# Altium schematic sheet NE-CurrentSense-V1.0.SchDoc: Oscilloscope Current Probe
size A4; SheetNumber: 1; SheetTotal: 1; ProjectName: Current Prbe
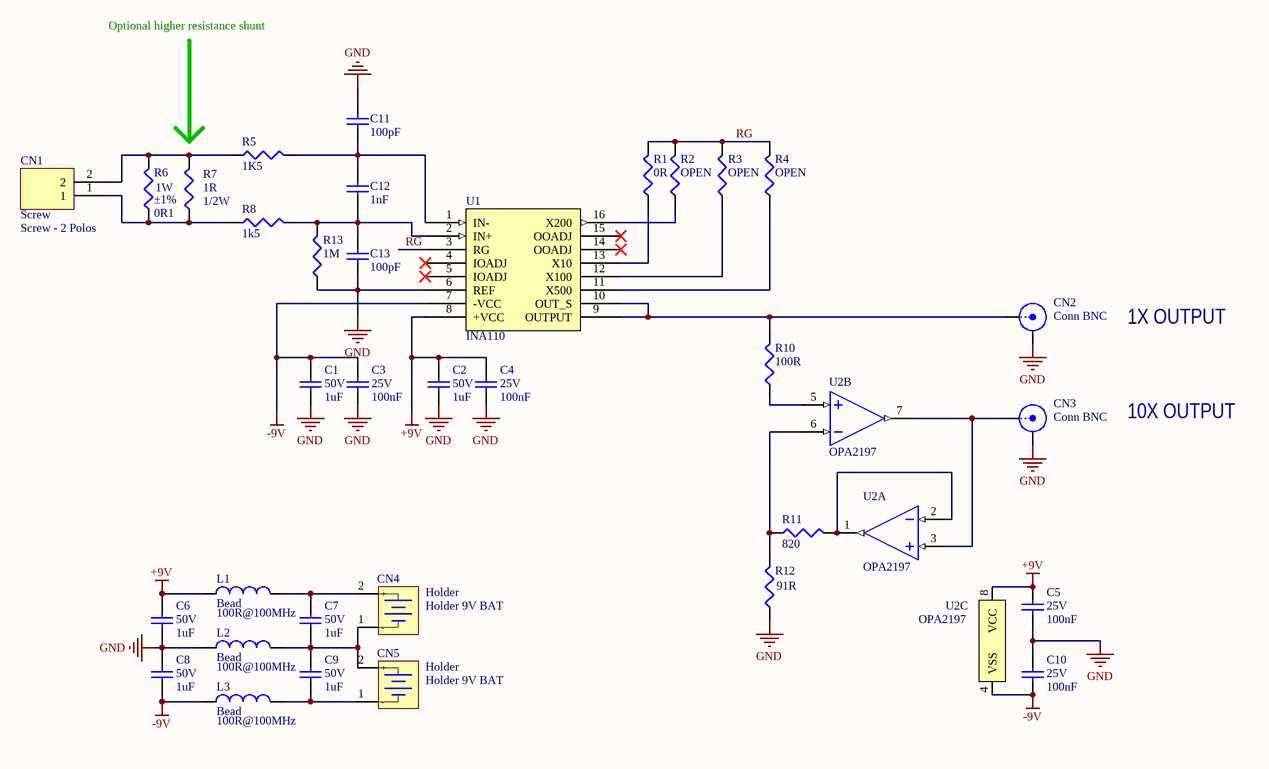
[diagram p0: NE-CurrentSense-V1.0.SchDoc]

## Parts
C1  value 1uF  Tensão: 50V  [CC0603]  (hidden comment: Capacitor Cerâmico)
C2  value 1uF  Tensão: 50V  [CC0603]  (hidden comment: Capacitor Cerâmico)
C3  value 100nF  Tensão: 25V  [CC0603]  (hidden comment: Capacitor Cerâmico)
C4  value 100nF  Tensão: 25V  [CC0603]  (hidden comment: Capacitor Cerâmico)
C5  value 100nF  Tensão: 25V  [CC0603]  (hidden comment: Capacitor Cerâmico)
C6  value 1uF  Tensão: 50V  [CC0603]  (hidden comment: Capacitor Cerâmico)
C7  value 1uF  Tensão: 50V  [CC0603]  (hidden comment: Capacitor Cerâmico)
C8  value 1uF  Tensão: 50V  [CC0603]  (hidden comment: Capacitor Cerâmico)
C9  value 1uF  Tensão: 50V  [CC0603]  (hidden comment: Capacitor Cerâmico)
C10  value 100nF  Tensão: 25V  [CC0603]  (hidden comment: Capacitor Cerâmico)
C11  value 100pF  [CC0603]  (hidden comment: Capacitor Cerâmico)  (no BOM)
C12  value 1nF  [CC0603]  (hidden comment: Capacitor Cerâmico)  (no BOM)
C13  value 100pF  [CC0603]  (hidden comment: Capacitor Cerâmico)  (no BOM)
CN1  Screw  value Screw - 2 Polos  [CONN SCREW-2N P5.08]
CN2  Conn BNC  [CONN BNC-JACK]
CN3  Conn BNC  [CONN BNC-JACK]
CN4  Holder  value Holder 9V BAT  [BATTHOLDER-9V-BH9V-PC-ND]
CN5  Holder  value Holder 9V BAT  [BATTHOLDER-9V-BH9V-PC-ND]
L1  Bead  value 100R@100MHz  [CC0603]
L2  Bead  value 100R@100MHz  [CC0603]
L3  Bead  value 100R@100MHz  [CC0603]
R1  value 0R  [CC0603]  (hidden comment: Resistor)
R2  value OPEN  [CC0603]  (hidden comment: Resistor Open)  (no BOM)
R3  value OPEN  [CC0603]  (hidden comment: Resistor Open)  (no BOM)
R4  value OPEN  [CC0603]  (hidden comment: Resistor Open)  (no BOM)
R5  value 1K5  [CC0603]  (hidden comment: Resistor)
R6  value 0R1  Potência: 1W  Tolerância: ±1%  [CC2010]  (hidden comment: Resistor)
R7  value 1R  Potência: 1/2W  [CC1206]  (hidden comment: Resistor)
R8  value 1k5  [CC0603]  (hidden comment: Resistor)
R10  value 100R  [CC0603]  (hidden comment: Resistor)
R11  value 820  [CC0603]  (hidden comment: Resistor)
R12  value 91R  [CC0603]  (hidden comment: Resistor)
R13  value 1M  [CC0603]  (hidden comment: Resistor)
U1  INA110  [SOIC-16N_WIDE]
U2  OPA2197  [SOIC-8N]  (parts A,B,C of 3)

## Nets
+9V: C2.2 C4.2 C5.2 C6.2 L1.1 U1.8(+VCC) U2.8(VCC)
-9V: C1.2 C3.2 C8.1 C10.1 L3.1 U1.7(-VCC) U2.4(VSS)
GND: C1.1 C2.1 C3.1 C4.1 C5.1 C6.1 C8.2 C10.2 C11.2 C13.1 CN2.2(Y) CN3.2(Y) L2.1 R12.1 R13.1 U1.6(REF)
RG: R1.2 R2.2 R3.2 R4.2 U1.3(RG)
NetC7_1: C7.1 C9.2 CN4.1(-) CN5.2(+) L2.2
NetC7_2: C7.2 CN4.2(+) L1.2
NetC9_1: C9.1 CN5.1(-) L3.2
NetC11_1: C11.1 C12.2 R5.2 U1.1(IN-)
NetC12_1: C12.1 C13.2 R8.2 R13.2 U1.2(IN+)
NetCN1_1: CN1.1 R6.1 R7.1 R8.1
NetCN1_2: CN1.2 R5.1 R6.2 R7.2
NetCN2_1: CN2.1(X) R10.2 U1.9(OUTPUT) U1.10(OUT_S)
NetCN3_1: CN3.1(X) U2.3(INA+) U2.7(OUTB)
NetR1_1: R1.1 U1.13(X10)
NetR2_1: R2.1 U1.16(X200)
NetR3_1: R3.1 U1.12(X100)
NetR4_1: R4.1 U1.11(X500)
NetR10_1: R10.1 U2.5(INB+)
NetR11_1: R11.1 R12.2 U2.6(INB-)
NetR11_2: R11.2 U2.1(OUTA) U2.2(INA-)

Not connected (* = marked no-connect by the designer): U1 4(IOADJ)* 5(IOADJ)* 14(OOADJ)* 15(OOADJ)*

## Notes on the sheet
- Optional higher resistance shunt
- 1X OUTPUT
- 10X OUTPUT
- Projeto:
- Tamanho:
- Data:
- A4
- Eng. Felipe Navarro
- Hora:
- Revisão:
- Folha
- de
- Arquivo:

## Library data of the parts
C1 C2 C6-C9 = Cap 1uF 50V 0603 X5R: Capacitor (Semiconductor SIM Model); Chinês: Local; ChinesePrice: 0,01100; Corrente: *A; Potência: *W; Obs:: X5R; Tolerância: ±10%; Supplier 1: Digi-Key; Supplier Part Number 1: 587-2400-1-ND; ComponentLink1Description: Datasheet; ComponentLink1URL: D:\Tecnoclade\Datasheet\!DataMissing.pdf
C3-C5 C10 = Cap 100nF 25V 0603 X7R: Capacitor (Semiconductor SIM Model); Chinês: Local; ChinesePrice: 0,00246; Corrente: *A; Potência: *W; Obs:: X7R; Tolerância: ±10%; Supplier 1: Digi-Key; Supplier Part Number 1: 490-1524-1-ND; ComponentLink1Description: Datasheet; ComponentLink1URL: D:\Tecnoclade\Datasheet\!DataMissing.pdf
C11-C13 = Cap OPEN 0603: Capacitor (Semiconductor SIM Model); Chinês: -----; ChinesePrice: 0,00000; Corrente: *A; Potência: *W; Tolerância: ±*%; Tensão: *V; Supplier 1: Digi-Key; Supplier Part Number 1: --Del; Obs:: *; ComponentLink1Description: Datasheet; ComponentLink1URL: D:\Tecnoclade\Datasheet\!DataMissing.pdf
CN1 = Screw-2 300V 12A P5.08mm: Conector Screw Block; ChinesePrice: 0,00000; Chinês: ----; Corrente: 12A; Tensão: 300VAC; Obs:: Through Hole, M3; Tolerância: 14-30 AWG; Potência: *; Supplier 1: Digi-Key; ComponentLink1Description: Datasheet; ComponentLink1URL: D:\Tecnoclade\Datasheet\!DataMissing.pdf
CN2 CN3 = Conn BNC: Conector BNC; ChinesePrice: 0,00000; Chinês: ----; Value: Jack BNC; Corrente: *; Potência: *; Supplier 1: Digi-Key; Supplier Part Number 1: A97569-ND; Tensão: *; Obs:: *; Tolerância: *; ComponentLink1Description: Datasheet; ComponentLink1URL: D:\Tecnoclade\Datasheet\!DataMissing.pdf
CN4 CN5 = BattHolder 9V: Corrente: *A; Chinês: ----; ChinesePrice: 0,00000; Tensão: *V; Potência: *; Supplier 1: Digi-Key; Supplier Part Number 1: BH9V-PC-ND; Obs:: *; Tolerância: *; ComponentLink1Description: Datasheet; ComponentLink1URL: D:\Tecnoclade\Datasheet\!DataMissing.pdf
L1-L3 = Bd 100R@100MHz 0603 2A: ChinesePrice: 0,00000; Chinês: ----; Obs:: Ferrite (0R04); Tolerância: ±25%; Corrente: 2A; Potência: *; Supplier 1: Digi-Key; Supplier Part Number 1: 445-2984-1-ND; Tensão: *; ComponentLink1Description: Datasheet; ComponentLink1URL: D:\Tecnoclade\Datasheet\!DataMissing.pdf; Substituição: 00/00/0000
R1 R5 R8 = Res 0R 0603 1/10W: ChinesePrice: 0,00089; Chinês: Local; Corrente: *A; Potência: 1/10W; Tensão: *V; Tolerância: Jumper; Supplier 1: Digi-Key; Supplier Part Number 1: P0.0GCT-ND; Obs: *; ComponentLink1Description: Datasheet; ComponentLink1URL: D:\Tecnoclade\Datasheet\!DataMissing.pdf
R2-R4 = Res Open 0603: Resistor; ChinesePrice: 0,00000; Chinês: ----; Corrente: *A; Potência: *W; Tensão: *V; Tolerância: ±*%; Supplier 1: Digi-Key; Supplier Part Number 1: --Del; Obs:: *; ComponentLink1Description: Datasheet; ComponentLink1URL: D:\Tecnoclade\Datasheet\!DataMissing.pdf
R6 = Shunt 0R1 1% 2010 1W: Resistor Shunt; ChinesePrice: 0,02300; Chinês: Local; Corrente: *A; Tensão: *V; Supplier 1: Digi-Key; Supplier Part Number 1: CRM2010-FX-R100ELFCT-ND; Obs: *; ComponentLink1Description: Datasheet; ComponentLink1URL: D:\Tecnoclade\Datasheet\!DataMissing.pdf
R7 = Res 931R 1% 0603 1/10W: ChinesePrice: 0,00110; Chinês: Local; Corrente: *A; Tensão: *V; Obs: ±100ppm/ºC; Tolerância: ±1%; Supplier 1: Digi-Key; Supplier Part Number 1: RMCF0603FT931RCT-ND; ComponentLink1Description: Datasheet; ComponentLink1URL: D:\Tecnoclade\Datasheet\!DataMissing.pdf
R10 = Res 100R 5% 0603 1/10W: ChinesePrice: 0,00080; Chinês: Local; Corrente: *A; Potência: 1/10W; Tensão: *V; Tolerância: ±5%; Supplier 1: Digi-Key; Supplier Part Number 1: RMCF0603JT100RCT-ND; Obs: *; ComponentLink1Description: Datasheet; ComponentLink1URL: D:\Tecnoclade\Datasheet\!DataMissing.pdf
R11 = Res 9K76 1% 0603 1/10W: ChinesePrice: 0,00000; Chinês: ----; Corrente: *A; Potência: 1/10W; Tensão: *V; Obs: ±100ppm/ºC; Tolerância: ±1%; Supplier 1: Digi-Key; Supplier Part Number 1: 311-8.20KHRCT-ND; ComponentLink1Description: Datasheet; ComponentLink1URL: D:\Tecnoclade\Datasheet\!DataMissing.pdf
R12 = Res 976R 1% 0603 1/10W: ChinesePrice: 0,00000; Chinês: ----; Corrente: *A; Potência: 1/10W; Tensão: *V; Obs: ±100ppm/ºC; Tolerância: ±1%; Supplier 1: Digi-Key; Supplier Part Number 1: 311-910LRCT-ND; ComponentLink1Description: Datasheet; ComponentLink1URL: D:\Tecnoclade\Datasheet\!DataMissing.pdf
R13 = Res 1M 1% 0603 1/10W: ChinesePrice: 0,00089; Chinês: Local; Corrente: *A; Potência: 1/10W; Tensão: *V; Obs: ±100ppm/ºC; Tolerância: ±1%; Supplier 1: Digi-Key; Supplier Part Number 1: RMCF0603FT1M00CT-ND; ComponentLink1Description: Datasheet; ComponentLink1URL: D:\Tecnoclade\Datasheet\!DataMissing.pdf
U1 = INA110: Fast-Settling FET-Input  INSTRUMENTATION AMPLIFIER; ChinesePrice: 0,00000; Chinês: ----; Supplier 1: Digi-Key; Supplier Part Number 1: INA110KU-ND; Corrente: *; Potência: *; Tensão: *; Value: *; Obs:: *; Tolerância: *; ComponentLink1Description: Datasheet; ComponentLink1URL: D:\Tecnoclade\Datasheet\
U2 = OPA2197: OPAx197 36-V, Precision, Rail-to-Rail Input/Output, Low Offset Voltage, Operational Amplifiers; Chinês: ----; ChinesePrice: 0,00000; Tensão: 36V; Value: 10MHz; Corrente: 65mA; Potência: *; Supplier 1: Digi-Key; Obs:: Rail-To-Rail; Tolerância: *; ComponentLink1Description: Datasheet; ComponentLink1URL: D:\Tecnoclade\Datasheet\